# EAGLE schematic sensor_schematics (EAGLE 6.5.0)
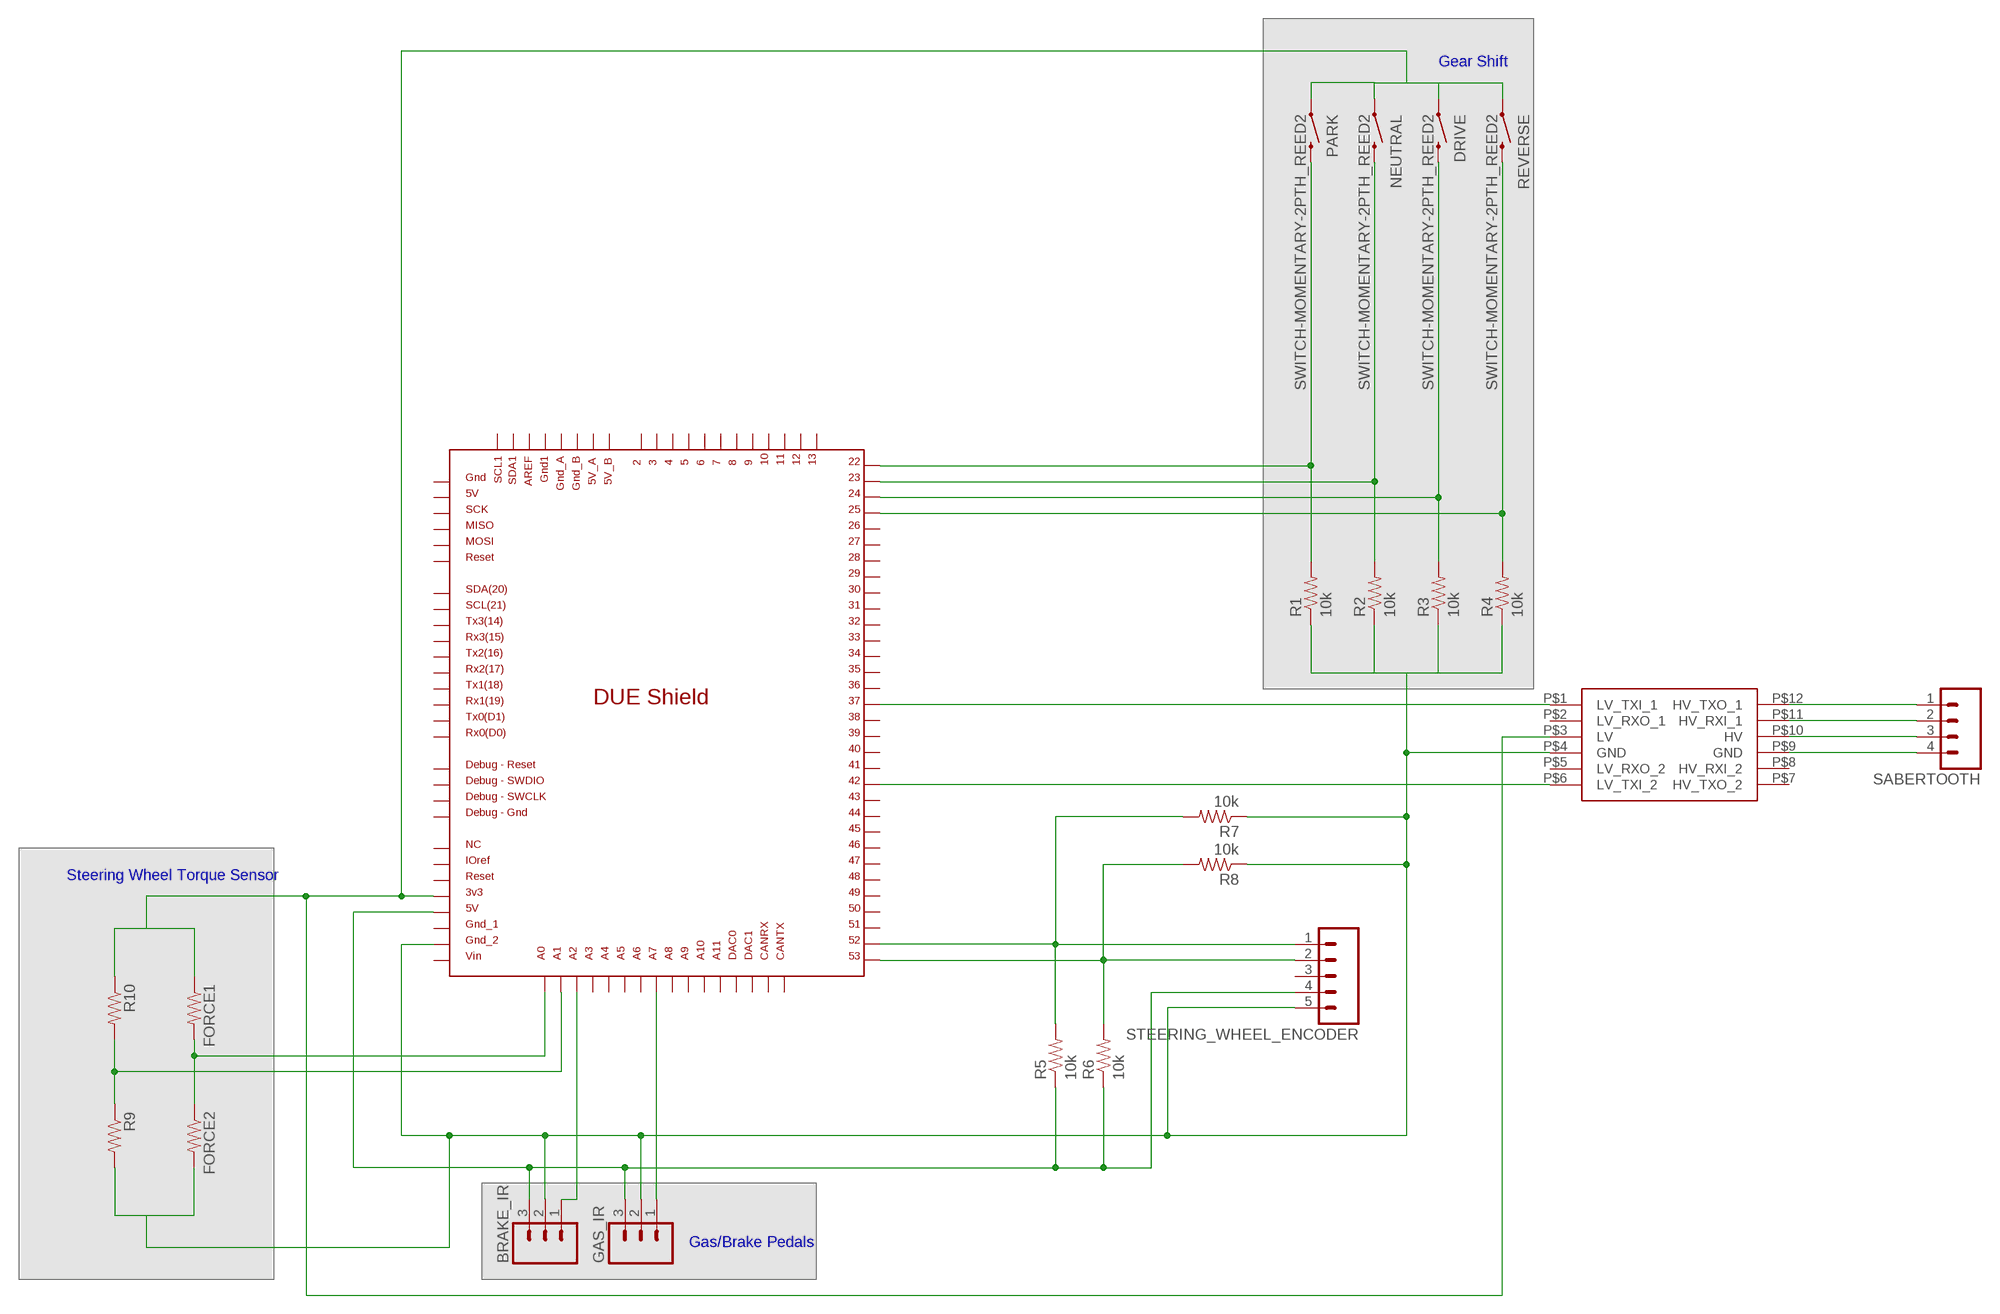
[diagram p0: schematic, sheet 1]

## Parts
BRAKE_IR  M03PTH  [1X03]
DRIVE  SWITCH-MOMENTARY-2PTH_REED2  [REED_SWITCH_PLASTIC]
FORCE1  RESISTOREZ  [AXIAL-0.3EZ]
FORCE2  RESISTOREZ  [AXIAL-0.3EZ]
GAS_IR  M03PTH  [1X03]
NEUTRAL  SWITCH-MOMENTARY-2PTH_REED2  [REED_SWITCH_PLASTIC]
PARK  SWITCH-MOMENTARY-2PTH_REED2  [REED_SWITCH_PLASTIC]
R1  10k  RESISTOREZ  [AXIAL-0.3EZ]
R2  10k  RESISTOREZ  [AXIAL-0.3EZ]
R3  10k  RESISTOREZ  [AXIAL-0.3EZ]
R4  10k  RESISTOREZ  [AXIAL-0.3EZ]
R5  10k  RESISTOREZ  [AXIAL-0.3EZ]
R6  10k  RESISTOREZ  [AXIAL-0.3EZ]
R7  10k  RESISTOREZ  [AXIAL-0.3EZ]
R8  10k  RESISTOREZ  [AXIAL-0.3EZ]
R9  RESISTOREZ  [AXIAL-0.3EZ]
R10  RESISTOREZ  [AXIAL-0.3EZ]
REVERSE  SWITCH-MOMENTARY-2PTH_REED2  [REED_SWITCH_PLASTIC]
SABERTOOTH  M04PTH  [1X04]
STEERING_WHEEL_ENCODER  M05PTH  [1X05]
U$1  DUE(NORMAL)  [DUE(NORMAL)]
U$2  LOGIC_LEVEL_CONVERTER  [LOGIC_LEVEL_CONVERTER]

## Nets
N$1: DRIVE.P$1 FORCE1.P$1 NEUTRAL.P$1 PARK.P$1 R10.P$1 REVERSE.P$1 U$1.3V3 U$2.P$3(LV)
N$3: BRAKE_IR.1 U$1.A2
N$4: GAS_IR.1 U$1.A7
N$5: NEUTRAL.P$2 R2.P$2 U$1.23
N$6: DRIVE.P$2 R3.P$2 U$1.24
N$7: R4.P$2 REVERSE.P$2 U$1.25
N$8: BRAKE_IR.3 GAS_IR.3 R5.P$1 R6.P$1 STEERING_WHEEL_ENCODER.4 U$1.5V
N$9: R6.P$2 R8.P$2 STEERING_WHEEL_ENCODER.2 U$1.53
N$10: R5.P$2 R7.P$2 STEERING_WHEEL_ENCODER.1 U$1.52
N$11: SABERTOOTH.1 U$2.P$12(HV_TXO_1)
N$12: SABERTOOTH.2 U$2.P$11(HV_RXI_1)
N$13: SABERTOOTH.3 U$2.P$10(HV)
N$14: SABERTOOTH.4 U$2.P$9(GND)
N$15: U$1.37 U$2.P$1(LV_TXI_1)
N$16: U$1.42 U$2.P$6(LV_TXI_2)
N$17: R9.P$1 R10.P$2 U$1.A1
N$18: FORCE1.P$2 FORCE2.P$1 U$1.A0
N$19: BRAKE_IR.2 FORCE2.P$2 GAS_IR.2 R1.P$1 R2.P$1 R3.P$1 R4.P$1 R7.P$1 R8.P$1 R9.P$2 STEERING_WHEEL_ENCODER.5 U$1.GND_2 U$2.P$4(GND)
PARK: PARK.P$2 R1.P$2 U$1.22
Unconnected: STEERING_WHEEL_ENCODER.3 U$1.2 U$1.3 U$1.4 U$1.5 U$1.5V_A U$1.5V_B U$1.5V_ICSP U$1.6 U$1.7 U$1.8 U$1.9 U$1.10 U$1.11 U$1.12 U$1.13 U$1.26 U$1.27 U$1.28 U$1.29 U$1.30 U$1.31 U$1.32 U$1.33 U$1.34 U$1.35 U$1.36 U$1.38 U$1.39 U$1.40 U$1.41 U$1.43 U$1.44 U$1.45 U$1.46 U$1.47 U$1.48 U$1.49 U$1.50 U$1.51 U$1.A3 U$1.A4 U$1.A5 U$1.A6 U$1.A8 U$1.A9 U$1.A10 U$1.A11 U$1.AREF U$1.CANRX U$1.CANTX U$1.DAC0 U$1.DAC1 U$1.GND1 U$1.GND_1 U$1.GND_A U$1.GND_B U$1.GND_DEBUG U$1.GND_ICSP U$1.IOREF U$1.MISO_ICSP U$1.MOSI_ICSP U$1.NC U$1.RESET U$1.RESET_DEBUG U$1.RESET_ICSP U$1.RX0 U$1.RX1 U$1.RX2 U$1.RX3 U$1.SCK_ICSP U$1.SCL U$1.SCL1 U$1.SDA U$1.SDA1 U$1.SWCLK_DEBUG U$1.SWDIO_DEBUG U$1.TX0 U$1.TX1 U$1.TX2 U$1.TX3 U$1.VIN U$2.P$2(LV_RXO_1) U$2.P$5(LV_RXO_2) U$2.P$7(HV_TXO_2) U$2.P$8(HV_RXI_2)

## Notes on the sheet
- Gear Shift
- Steering Wheel Torque Sensor
- Gas/Brake Pedals

## Library data of the parts
BRAKE_IR GAS_IR = SparkFun-Connectors:M03: Header 3 Standard 3-pin 0.1" header. Use with straight break away headers (SKU : PRT-00116), right angle break away headers (PRT-00553), swiss pins (PRT-00743), machine pins (PRT-00117), and female headers (PRT-00115). Molex polarized connector foot print use with SKU : PRT-08232 with associated crimp pins and housings.
DRIVE NEUTRAL PARK REVERSE = SparkFun-Electromechanical:SWITCH-MOMENTARY-2: Various NO switches- pushbuttons, reed, etc
FORCE1 FORCE2 R1-R10 = SparkFun-Passives:RESISTOR: Resistor Basic schematic elements and footprints for 0603, 1206, and PTH resistors.
SABERTOOTH = SparkFun-Connectors:M04: Header 4 Standard 4-pin 0.1" header. Use with straight break away headers (SKU : PRT-00116), right angle break away headers (PRT-00553), swiss pins (PRT-00743), machine pins (PRT-00117), and female headers (PRT-00115). Molex polarized connector foot print use with SKU : PRT-08231 with associated crimp pins and housings. 1MM SMD Version SKU: PRT-10208
STEERING_WHEEL_ENCODER = SparkFun-Connectors:M05: Header 5 Standard 5-pin 0.1" header. Use with straight break away headers (SKU : PRT-00116), right angle break away headers (PRT-00553), swiss pins (PRT-00743), machine pins (PRT-00117), and female headers (PRT-00115). Molex polarized connector foot print use with SKU : PRT-08230 with associated crimp pins and housings.
U$1 = DUElib130425:DUE(NORMAL)
U$2 = SparkFun-Boards:LOGIC_LEVEL_CONVERTER: Logic Level Converter (3.3v - 5v) https://www.sparkfun.com/products/8745